# EAGLE design PROTOshield (EAGLE 9.2.0)
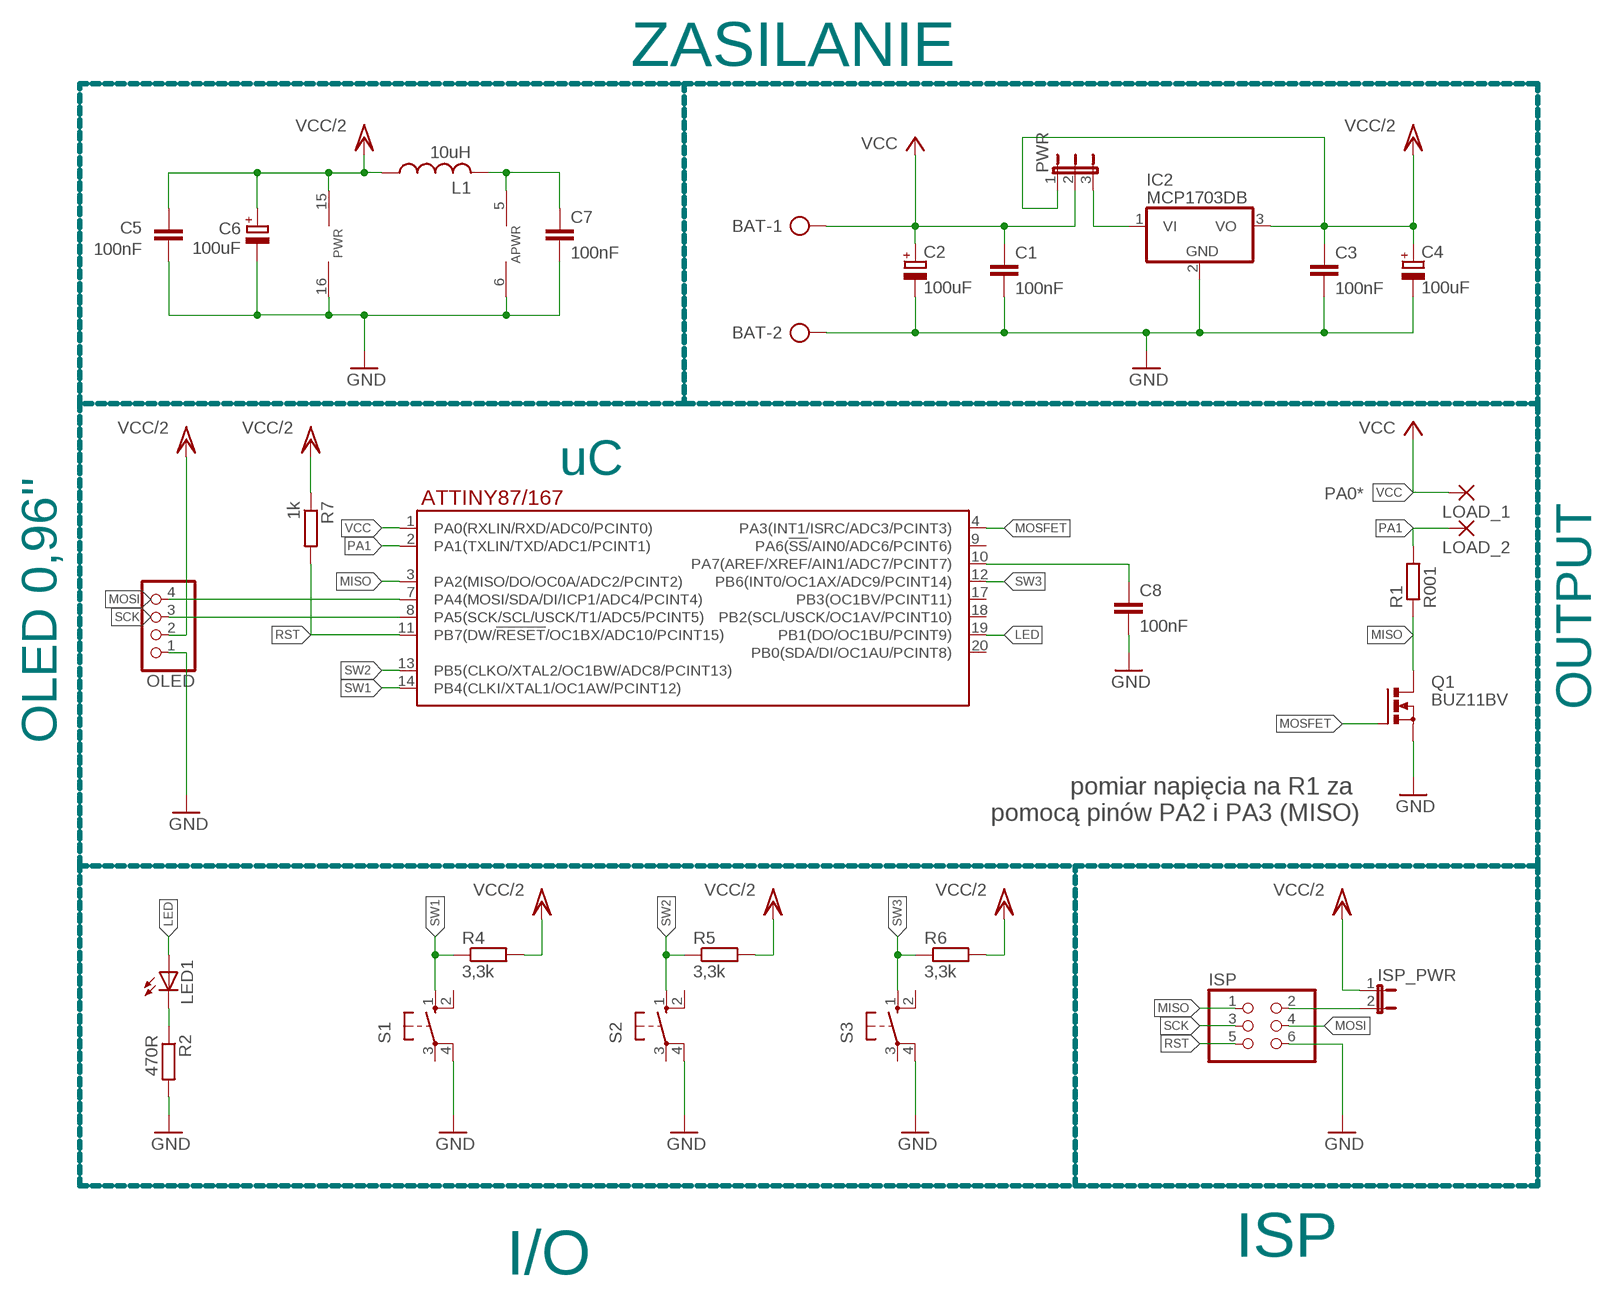
[diagram p0: schematic, sheet 1]

## Parts
BAT  AK300/2  [AK300/2]
C1  100nF  C-EU050-045X075  [C050-045X075]
C2  100uF  CPOL-EUE3.5-8  [E3,5-8]
C3  100nF  C-EU050-045X075  [C050-045X075]
C4  100uF  CPOL-EUE3.5-8  [E3,5-8]
C5  100nF  C-EU050-045X075  [C050-045X075]
C6  100uF  CPOL-EUE3.5-8  [E3,5-8]
C7  100nF  C-EU050-045X075  [C050-045X075]
C8  100nF  C-EU050-045X075  [C050-045X075]
IC2  MCP1703DB  [SOT223]
ISP  PINHD-2X3  [2X03]
ISP_PWR  JP1E  [JP1]
L1  10uH  L-US0207/7  [0207/7]
LED1  LED5MM  [LED5MM]
LOAD_1  3,81/1,3  [3,81/1,3]
LOAD_2  3,81/1,3  [3,81/1,3]
OLED  PINHD-1X4  [1X04]
PWR  JP2E  [JP2]
Q1  BUZ11BV  [TO220BV]
R1  R001  R-EU_R2512  [R2512]
R2  470R  R-EU_R1206  [R1206]
R4  3,3k  R-EU_R1206  [R1206]
R5  3,3k  R-EU_R1206  [R1206]
R6  3,3k  R-EU_R1206  [R1206]
R7  1k  R-EU_R1206  [R1206]
S1  10-XX  [B3F-10XX]
S2  10-XX  [B3F-10XX]
S3  10-XX  [B3F-10XX]
U$1  ATTINY87/167  [SOIC127P1032X265-20N]

## Nets
GND: BAT.2 C1.2 C2.- C3.2 C4.- C5.2 C6.- C7.2 C8.2 IC2.2(GND) ISP.6 OLED.1 Q1.S R2.2 S1.4(P1) S2.4(P1) S3.4(P1) U$1.6(AGND) U$1.16(GND)
LED: LED1.A U$1.19(PB1(DO/OC1BU/PCINT9))
MISO: ISP.1 Q1.D R1.1 U$1.3(PA2(MISO/DO/OC0A/ADC2/PCINT2))
MOSFET: Q1.G U$1.4(PA3(INT1/ISRC/ADC3/PCINT3))
MOSI: ISP.4 OLED.4 U$1.7(PA4(MOSI/SDA/DI/ICP1/ADC4/PCINT4))
N$1: LED1.K(C) R2.1
N$2: IC2.1(VI) PWR.3
N$4: ISP.2 ISP_PWR.2
N$5: C8.1 U$1.10(PA7(AREF/XREF/AIN1/ADC7/PCINT7))
N$7: C7.1 L1.2 U$1.5(AVCC)
PA1: LOAD_2.1(P) R1.2 U$1.2(PA1(TXLIN/TXD/ADC1/PCINT1))
RST: ISP.5 R7.2 U$1.11(PB7(DW/!RESET!/OC1BX/ADC10/PCINT15))
SCK: ISP.3 OLED.3 U$1.8(PA5(SCK/SCL/USCK/T1/ADC5/PCINT5))
SW1: R4.1 S1.1(S) U$1.14(PB4(CLKI/XTAL1/OC1AW/PCINT12))
SW2: R5.1 S2.1(S) U$1.13(PB5(CLKO/XTAL2/OC1BW/ADC8/PCINT13))
SW3: R6.1 S3.1(S) U$1.12(PB6(INT0/OC1AX/ADC9/PCINT14))
VCC: BAT.1 C1.1 C2.+ LOAD_1.1(P) PWR.2 U$1.1(PA0(RXLIN/RXD/ADC0/PCINT0))
VCC/2: C3.1 C4.+ C5.1 C6.+ IC2.3(VO) ISP_PWR.1 L1.1 OLED.2 PWR.1 R4.2 R5.2 R6.2 R7.1 U$1.15(VCC)
Unconnected: S1.2(S1) S1.3(P) S2.2(S1) S2.3(P) S3.2(S1) S3.3(P) U$1.9(PA6(!SS!/AIN0/ADC6/PCINT6)) U$1.17(PB3(OC1BV/PCINT11)) U$1.18(PB2(SCL/USCK/OC1AV/PCINT10)) U$1.20(PB0(SDA/DI/OC1AU/PCINT8))

## Notes on the sheet
- ZASILANIE
- uC
- PA0*
- OUTPUT
- OLED 0,96''
- pomiar napięcia na R1 za 
  pomocą pinów PA2 i PA3 (MISO)
- I/O | ISP

## Library data of the parts
BAT = con-ptr500:AK300/2: CONNECTOR; OC_FARNELL: unknown; OC_NEWARK: unknown
C1 C3 C5 C7 C8 = rcl:C-EU: CAPACITOR, European symbol; SPICEPREFIX: C
C2 C4 C6 = rcl:CPOL-EU: POLARIZED CAPACITOR, European symbol; SPICEPREFIX: C
IC2 = linear:MCP1703: 250 mA, 16V, Low Quiescent Current LDO Regulator Source: http://ww1.microchip.com/downloads/en/DeviceDoc/22049b.pdf
ISP = pinhead:PINHD-2X3: PIN HEADER
ISP_PWR = jumper:JP1E: JUMPER
L1 = rcl:L-US: INDUCTOR, American symbol; SPICEPREFIX: L
LED1 = led:LED: LED OSRAM: - CHIPLED LG R971, LG N971, LY N971, LG Q971, LY Q971, LO R971, LY R971 LH N974, LH R974 LS Q976, LO Q976, LY Q976 LO Q996 - Hyper CHIPLED LW Q18S LB Q993, LB Q99A, LB R99A - SideLED LS A670, LO A670, LY A670, LG A670, LP A670 LB A673, LV A673, LT A673, LW A673 LH A674 LY A675 LS A676, LA A676, LO A676, LY A676, LW A676 LS A679, LY A679, LG A679 - Hyper Micro SIDELED® LS Y876, LA Y876, LO Y876, LY Y876 LT Y87S - SmartLED LW L88C, LW L88S LB L89C, LB L89S, LG L890 LS L89K, LO L89K, LY L89K LS L896, LA L896, LO L896, LY L896 - TOPLED LS T670, LO T670, LY T670, LG T670, LP T670 LSG T670, LSP T670, LSY T670, LOP T670, LYG T670 LG T671, LOG T671, LSG T671 LB T673, LV T673, LT T673, LW T673 LH T674 LS T676, LA T676, LO T676, LY T676, LB T676, LH T676, LSB T676, LW T676 LB T67C, LV T67C, LT T67C, LS T67K, LO T67K, LY T67K, LW E67C LS E67B, LA E67B, LO E67B, LY E67B, LB E67C, LV E67C, LT E67C LW T67C LS T679, LY T679, LG T679 LS T770, LO T770, LY T770, LG T770, LP T770 LB T773, LV T773, LT T773, LW T773 LH T774 LS E675, LA E675, LY E675, LS T675 LS T776, LA T776, LO T776, LY T776, LB T776 LHGB T686 LT T68C, LB T68C - Hyper Mini TOPLED® LB M676 - Mini TOPLED Santana® LG M470 LS M47K, LO M47K, LY M47K Source: http://www.osram.convergy.de LUXEON: - LUMILED® LXK2-PW12-R00, LXK2-PW12-S00, LXK2-PW14-U00, LXK2-PW14-V00 LXK2-PM12-R00, LXK2-PM12-S00, LXK2-PM14-U00 LXK2-PE12-Q00, LXK2-PE12-R00, LXK2-PE12-S00, LXK2-PE14-T00, LXK2-PE14-U00 LXK2-PB12-K00, LXK2-PB12-L00, LXK2-PB12-M00, LXK2-PB14-N00, LXK2-PB14-P00, LXK2-PB14-Q00 LXK2-PR12-L00, LXK2-PR12-M00, LXK2-PR14-Q00, LXK2-PR14-R00 LXK2-PD12-Q00, LXK2-PD12-R00, LXK2-PD12-S00 LXK2-PH12-R00, LXK2-PH12-S00 LXK2-PL12-P00, LXK2-PL12-Q00, LXK2-PL12-R00 Source: www.luxeon.com KINGBRIGHT: KA-3528ASYC Source: www.kingbright.com
LOAD_1 LOAD_2 = wirepad:3,81/1,3: THROUGH-HOLE PAD
OLED = pinhead:PINHD-1X4: PIN HEADER
PWR = jumper:JP2E: JUMPER
Q1 = transistor-power:BUZ11: N-CHANNEL MOS FET
R1 R2 R4-R7 = rcl:R-EU_: RESISTOR, European symbol; SPICEPREFIX: R
S1-S3 = switch-omron:10-XX: OMRON SWITCH; MPN: B3F-1000; OC_FARNELL: 176432; OC_NEWARK: 36M3542
U$1 = atmel_tiny87-167:ATTINY87/167

## Board
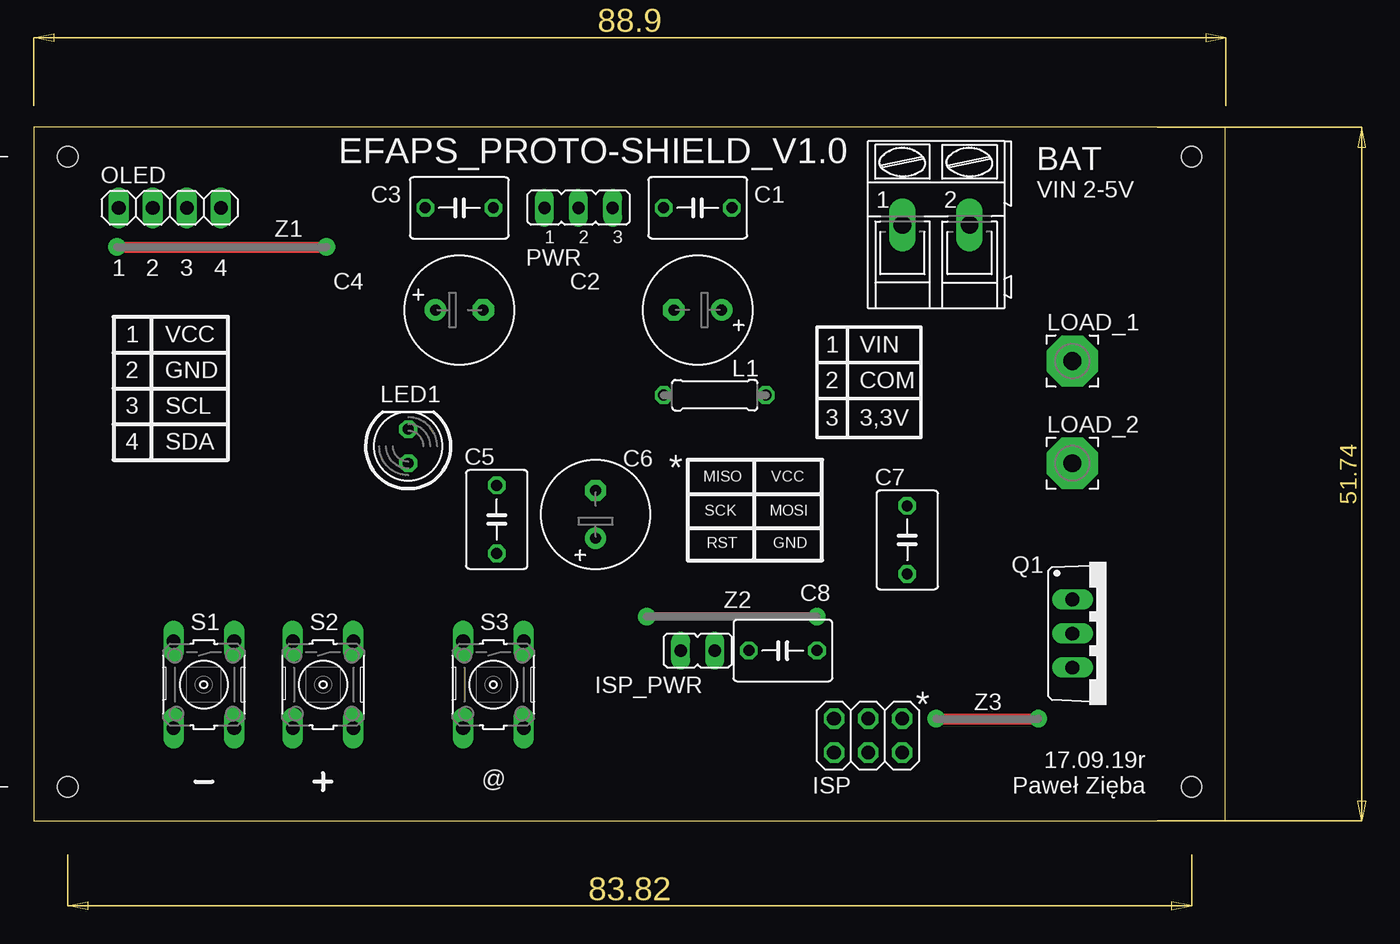
[diagram p1: board, top side]
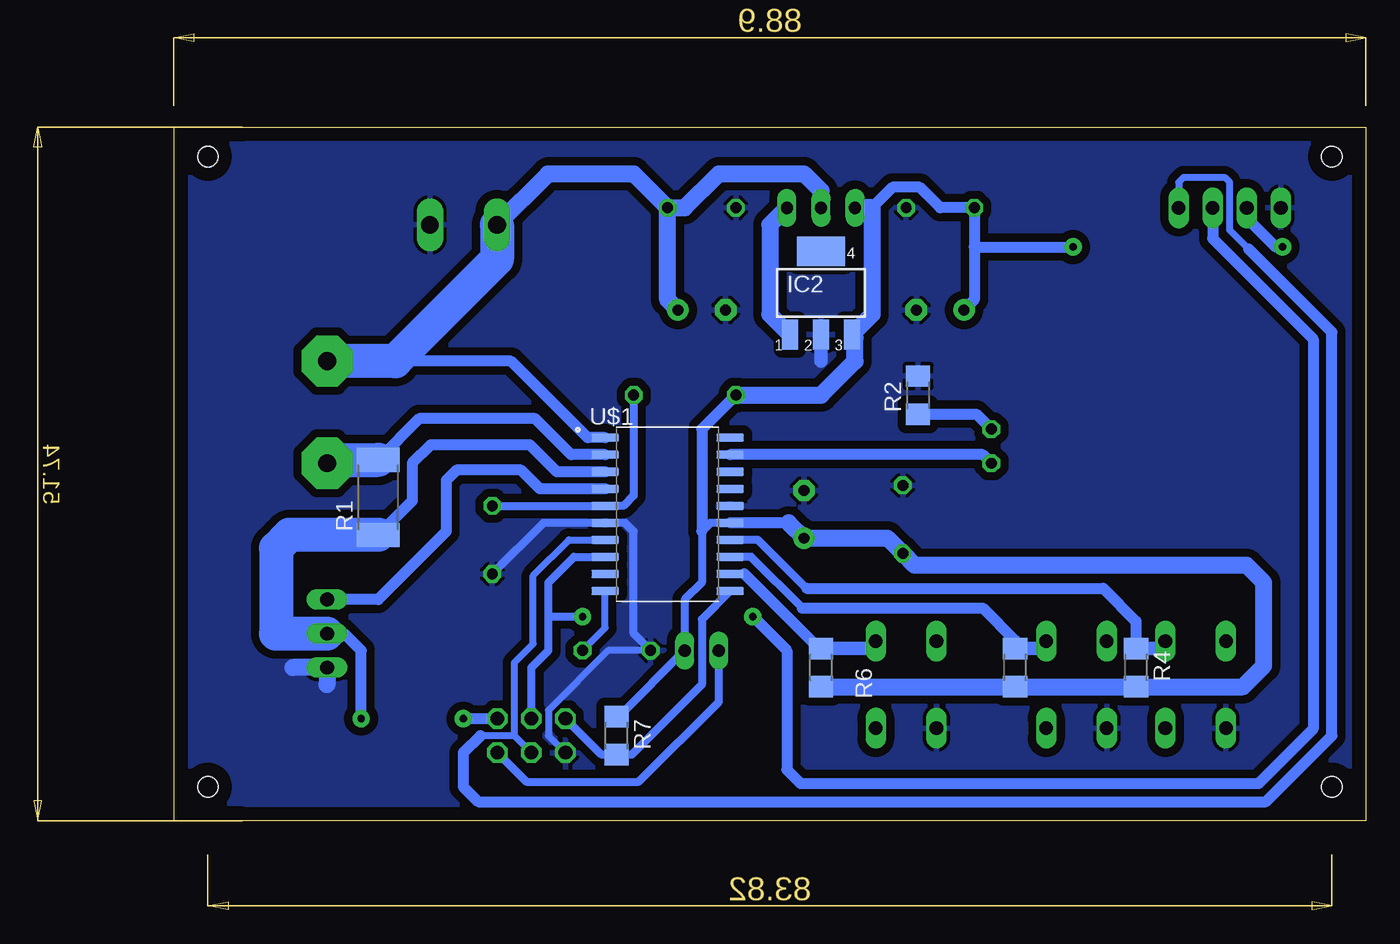
[diagram p2: board, bottom side, seen from below]

Size 88.88 x 51.74 mm. Coordinates in mm from the lower left corner, seen from the top.
Outline: 0,0 88.88,0 88.88,51.74 0,51.74 0,0
Copper layers (1*16): Top 0.035mm / dielectric 1.5mm / Bottom 0.035mm
Design rules "default": minimum track width 6mil, minimum drill 0.35mm, track to track 6mil, track to pad 6mil, pad to pad 6mil, via to via 6mil, smd to smd 6mil, copper to edge 40mil, drill to drill 6mil, minimum pad ring 10mil, minimum via ring 8mil, stop-mask expansion 4mil, vias tented up to drill 0mil, thermal gap 10mil
Holes 1.52 mm at 2.54,49.53 2.54,2.54 86.36,2.54 86.36,49.53

### Footprints (pad centres in the part's own frame; a part is rotated, then mirrored left to right if it is on the bottom)
AK300/2 = drill 1.321 long: 1 -2.515,0; 2 2.489,0
C050-045X075 = drill 0.813 octagon: 1 -2.54,0; 2 2.54,0
E3,5-8 = drill 0.813 pad 1.6: + -1.778,0 | drill 0.813 pad 1.6 octagon: - 1.778,0
SOT223 = smd 1.219 x 2.235: 1 -2.311,-3.099; 2 0,-3.099; 3 2.311,-3.099 | smd 3.6 x 2.2: 4 0,3.099
2X03 = drill 1.016 octagon: 1 -2.54,-1.27; 2 -2.54,1.27; 3 0,-1.27; 4 0,1.27; 5 2.54,-1.27; 6 2.54,1.27
JP1 = drill 0.914 long: 1 0,-1.27; 2 0,1.27
0207/7 = drill 0.813 octagon: 1 -3.81,0; 2 3.81,0
LED5MM = drill 0.813 octagon: A -1.27,0; K 1.27,0
3,81/1,3 = drill 1.321 pad 3.81 octagon: 1 0,0
1X04 = drill 1.016 long: 1 -3.81,0; 2 -1.27,0; 3 1.27,0; 4 3.81,0
JP2 = drill 0.914 long: 1 -2.54,0; 2 0,0; 3 2.54,0
TO220BV = drill 1.016 long: D 0,-2.54; G -2.54,-2.54; S 2.54,-2.54
R2512 = smd 1.8 x 3.2: 1 -2.8,0; 2 2.8,0
R1206 = smd 1.6 x 1.803: 1 -1.422,0; 2 1.422,0
B3F-10XX = drill 1.016 long: 1 -3.251,2.261; 2 3.251,2.261; 3 -3.251,-2.261; 4 3.251,-2.261
SOIC127P1032X265-20N = smd 2.05 x 0.6: 1 -4.655,5.715; 2 -4.655,4.445; 3 -4.655,3.175; 4 -4.655,1.905; 5 -4.655,0.635; 6 -4.655,-0.635; 7 -4.655,-1.905; 8 -4.655,-3.175; 9 -4.655,-4.445; 10 -4.655,-5.715; 11 4.655,-5.715; 12 4.655,-4.445; 13 4.655,-3.175; 14 4.655,-1.905; 15 4.655,-0.635; 16 4.655,0.635; 17 4.655,1.905; 18 4.655,3.175; 19 4.655,4.445; 20 4.655,5.715

### Placement (x,y rotation side)
BAT  67.31,44.45 0 top
C1  49.53,45.72 180 top
C2  49.53,38.1 180 top
C3  31.75,45.72 0 top
C4  31.75,38.1 0 top
C5  34.54,22.48 90 top
C6  41.91,22.86 90 top
C7  65.15,20.95 270 top
C8  55.88,12.7 180 top
IC2  40.64,39.37 0 bottom
ISP  62.23,6.35 180 top
ISP_PWR  49.53,12.7 90 top
L1  50.8,31.75 0 top
LED1  27.94,27.94 90 top
LOAD_1  77.47,34.29 0 top
LOAD_2  77.47,26.67 0 top
OLED  10.16,45.72 0 top
PWR  40.64,45.72 0 top
Q1  80.01,13.97 270 top
R1  73.66,24.13 90 bottom
R2  33.4,31.75 90 bottom
R4  17.14,11.43 270 bottom
R5  26.16,11.43 270 bottom
R6  40.64,11.43 270 bottom
R7  55.88,6.35 270 bottom
S1  12.7,10.16 270 top
S2  21.59,10.16 270 top
S3  34.29,10.16 270 top
U$1  52.07,22.86 0 bottom

### Tracks (layer width: path | path; a pad name or v marks a point on that pad's centre or on a via)
GND
  Bottom 0.508: C8.2 56.51,12.7 60.96,8.25 60.96,6.35 ISP.6
  Bottom 0.61: C8.2 54.61,13.97 54.61,21.59 55.24,22.22 U$1.6 61.34,22.22 C7.2
  Bottom 1.016: IC2.2 40.64,34.29
  Bottom 1.27: 77.47,10.16 Q1.S 80.01,11.43
  pour Bottom (isolate 0.61): 0,52.07 88.9,52.07 88.9,0 0,0
LED
  Bottom 0.813: LED1.A 28.57,27.3 U$1.19
MISO  (via drill 0.55 pad 1.3)
  Top 0.813: v67.31,7.62 v74.93,7.62
  Bottom 0.61: 80.27,21.33 80.65,20.95
  Bottom 0.813: U$1.3 60.32,26.03 62.36,28.07 69.72,28.07 71.12,26.67 71.12,23.87 R1.1 | ISP.1 v67.31,7.62 | v74.93,7.62 74.93,12.7 76.2,13.97 Q1.D
  Bottom 2.54: R1.1 80.27,21.33 | 80.65,20.95 81.28,20.32 81.28,13.97 Q1.D
MOSFET
  Bottom 0.813: U$1.4 61.59,24.77 62.99,26.16 67.82,26.16 68.58,25.4 68.58,21.59 73.66,16.51 Q1.G
MOSI
  Bottom 0.508: ISP.4 63.5,6.35 | U$1.7 59.44,20.95 62.1,18.29 62.1,13.21 63.5,11.81 63.5,6.35 | 63.5,6.35 66.04,6.35 | 8.76,42.67 10.16,44.07 10.16,47.62 10.54,48.01 13.59,48.01 13.97,47.62 OLED.4
  Bottom 0.813: 66.04,6.35 67.31,5.08 67.31,2.54 66.19,1.42 7.47,1.42 2.54,6.35 2.54,36.45 8.76,42.67
N$1
  Bottom 0.813: LED1.K 29.06,30.33 R2.1
N$2
  Bottom 0.61: 43.18,36.5 IC2.1
  Bottom 1.27: PWR.3 44.45,44.45 44.45,37.77 43.18,36.5
N$4
  Bottom 0.61: ISP.2 62.61,2.92 54.23,2.92 48.26,8.89 ISP_PWR.2
N$5
  Bottom 0.508: C8.1 56.73,14.39 U$1.10
N$7
  Bottom 0.61: C7.1 U$1.5 55.37,23.49 54.61,24.26 L1.2
PA1
  Bottom 0.813: U$1.2 59.26,27.3 61.95,29.99 70.6,29.99 R1.2
  Bottom 2.54: LOAD_2.1 77.21,26.93 R1.2
RST
  Bottom 0.61: ISP.5 57,4.93 R7.2 54.76,4.93 49.53,10.16 49.53,15.03 U$1.11
SCK  (via drill 0.55 pad 1.3)
  Top 0.61: v58.42,15.24 v45.72,15.24
  Bottom 0.61: ISP.3 62.23,11.43 60.96,12.7 60.96,15.24 | 60.96,15.24 60.96,17.78 59.05,19.68 U$1.8 | 60.96,15.24 v58.42,15.24
  Bottom 0.813: OLED.3 11.43,43.43 3.94,35.94 3.94,6.86 8,2.79 42.16,2.79 43.18,3.81 43.18,12.7 v45.72,15.24
SW1
  Bottom 0.61: 41.72,17.34 45.34,20.95 U$1.14
  Bottom 0.813: R4.1 17.14,14.88 19.6,17.34 41.72,17.34
  Bottom 1.016: R4.1 15.52,12.85 S1.1
SW2
  Bottom 0.61: 42.04,15.88 45.85,19.68 U$1.13
  Bottom 0.813: R5.1 26.16,13.46 28.57,15.88 42.04,15.88
  Bottom 1.016: R5.1 24.41,12.85 S2.1
SW3
  Bottom 0.61: R6.1 40.79,12.85 | 46.35,18.41 U$1.12
  Bottom 0.813: 40.79,12.85 46.35,18.41
  Bottom 1.016: S3.1 37.11,12.85 R6.1
VCC
  Bottom 0.813: U$1.1 58.04,28.58 63.75,34.29 LOAD_1.1
  Bottom 1.016: 61.01,48.24 60.93,48.26
  Bottom 1.27: BAT.1 61.01,48.24 | 60.93,48.26 54.61,48.26 C1.1 | C1.1 50.8,45.72 48.26,48.26 41.91,48.26 40.64,46.99 PWR.2 | C2.+ 52.07,38.86 C1.1
  Bottom 2.54: BAT.1 64.8,41.88 72.39,34.29 LOAD_1.1
VCC/2  (via drill 0.55 pad 1.3)
  Top 0.813: v6.22,42.8 v21.84,42.8
  Bottom 0.61: R7.1 55.73,7.77 ISP_PWR.1 50.8,16.51 49.53,17.78 49.53,21.59 48.9,22.22 U$1.15
  Bottom 0.813: 43.05,22.22 U$1.15 | L1.1 49.53,29.21 49.53,21.59 | 36.83,45.72 35.31,47.24 33.27,47.24 31.75,45.72 C3.1 29.21,42.8 | C4.+ 29.21,38.86 29.21,42.8 | 29.21,42.8 v21.84,42.8 | v6.22,42.8 6.73,42.8 8.89,44.96 OLED.2 | 9.17,10.01 9.04,10.13
  Bottom 1.016: 38.1,36.04 IC2.3
  Bottom 1.27: 43.05,22.22 C6.+ 35.69,21.08 C5.1 33.66,19.05 8.89,19.05 7.62,17.78 7.62,11.56 9.04,10.13 | R6.2 R5.2 R4.2 9.17,10.01 | PWR.1 36.83,45.72 36.83,37.77 IC2.3 | L1.1 40.64,31.75 38.1,34.29 38.1,36.04

### Text on the board
tPlace: EFAPS_PROTO-SHIELD_V1.0 | VIN 2-5V | Z1 | 1 | 2 | 3 | 4 | 1 VCC | 1 | VIN | 2 GND | 2 | COM | 3 SCL | 3 | 3,3V | 4 SDA | * | MISO | VCC | SCK | MOSI | RST | GND | Z2 | Z3 | * | 17.09.19r | Paweł Zięba | @